# EAGLE schematic big_8x48 (EAGLE 6.2)
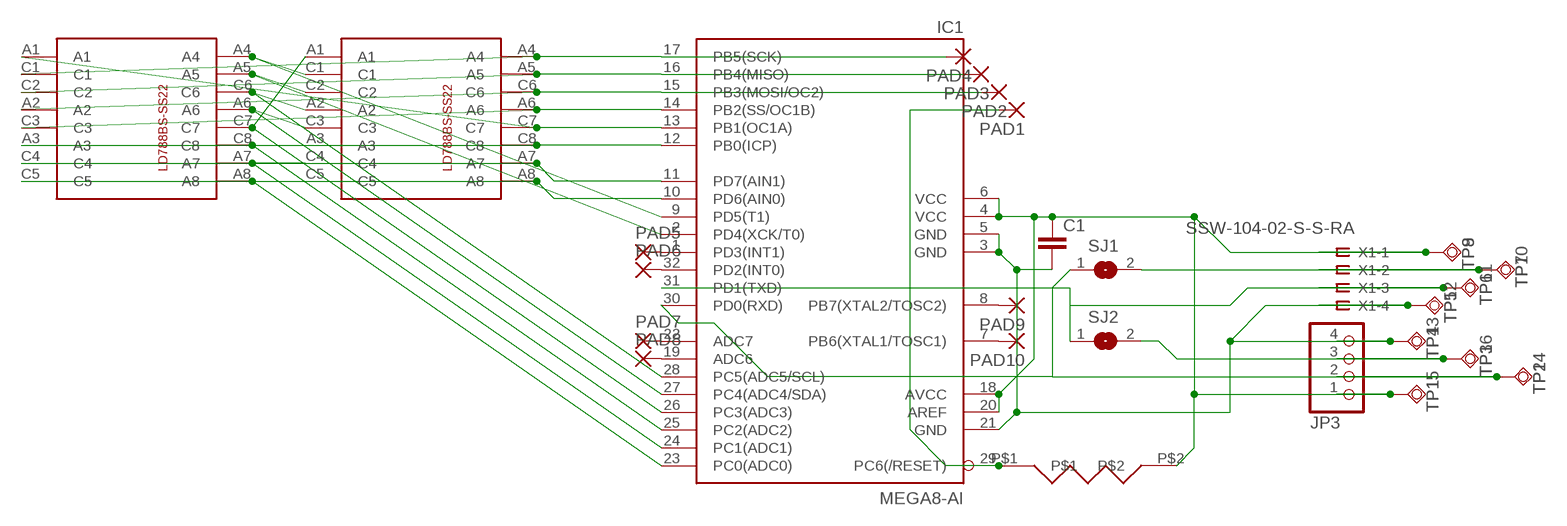
[diagram p0: schematic, sheet 1]

## Parts
C1  CAPPTH  [CAP-PTH-SMALL]
IC1  MEGA8-AI  [TQFP32-08]
JP3  PINHD-1X4/90  [1X04/90]
PAD1  1,6/0,8  [1,6/0,8]
PAD2  1,6/0,8  [1,6/0,8]
PAD3  1,6/0,8  [1,6/0,8]
PAD4  1,6/0,8  [1,6/0,8]
PAD5  1,6/0,8  [1,6/0,8]
PAD6  1,6/0,8  [1,6/0,8]
PAD7  1,6/0,8  [1,6/0,8]
PAD8  1,6/0,8  [1,6/0,8]
PAD9  1,6/0,8  [1,6/0,8]
PAD10  1,6/0,8  [1,6/0,8]
SJ1  SJ  [SJ]
SJ2  SJ  [SJ]
TP1  TPSQTP20SQ  [TP20SQ]
TP2  TPSQTP20SQ  [TP20SQ]
TP3  TPSQTP20SQ  [TP20SQ]
TP4  TPSQTP20SQ  [TP20SQ]
TP5  TPSQTP20SQ  [TP20SQ]
TP6  TPSQTP20SQ  [TP20SQ]
TP7  TPSQTP20SQ  [TP20SQ]
TP8  TPSQTP20SQ  [TP20SQ]
TP9  TPSQTP20SQ  [TP20SQ]
TP10  TPSQTP20SQ  [TP20SQ]
TP11  TPSQTP20SQ  [TP20SQ]
TP12  TPSQTP20SQ  [TP20SQ]
TP13  TPSQTP20SQ  [TP20SQ]
TP14  TPSQTP20SQ  [TP20SQ]
TP15  TPSQTP20SQ  [TP20SQ]
TP16  TPSQTP20SQ  [TP20SQ]
U$1  LD-1088BS  [LD-1088BS]
U$2  LD-1088BS  [LD-1088BS]
U$3  R-6  [R-6]
X1  SSW-104-02-S-S-RA  [SSW-104-02-S-S-RA]

## Nets
N$1: IC1.24(PC1(ADC1)) U$1.A7 U$2.C4
N$2: IC1.25(PC2(ADC2)) U$1.C8 U$2.A3
N$3: IC1.26(PC3(ADC3)) U$1.C7 U$2.A1
N$4: IC1.27(PC4(ADC4/SDA)) U$1.A6 U$2.C3
N$5: IC1.28(PC5(ADC5/SCL)) U$1.C6 U$2.A2
N$6: IC1.2(PD4(XCK/T0)) U$1.A5 U$2.C2
N$7: IC1.9(PD5(T1)) U$1.A4 U$2.C1
N$8: IC1.15(PB3(MOSI/OC2)) PAD2.1(P) U$1.A2 U$2.C6
N$9: IC1.14(PB2(SS/OC1B)) U$1.C3 U$2.A6
N$10: IC1.13(PB1(OC1A)) U$1.A1 U$2.C7
N$11: IC1.12(PB0(ICP)) U$1.A3 U$2.C8
N$12: IC1.11(PD7(AIN1)) U$1.C4 U$2.A7
N$13: IC1.10(PD6(AIN0)) U$1.C5 U$2.A8
N$14: IC1.16(PB4(MISO)) PAD3.1(P) U$1.C2 U$2.A5
N$15: IC1.17(PB5(SCK)) PAD4.1(P) U$1.C1 U$2.A4
N$16: IC1.1(PD3(INT1)) PAD5.1(P)
N$17: IC1.23(PC0(ADC0)) U$1.A8 U$2.C5
N$18: C1.2 IC1.3(GND) IC1.5(GND) IC1.21(GND) JP3.4 TP4.TP TP5.TP TP12.TP TP13.TP X1.4
N$19: C1.1 IC1.4(VCC) IC1.6(VCC) IC1.18(AVCC) IC1.20(AREF) JP3.1 TP1.TP TP8.TP TP9.TP TP15.TP U$3.P$2 X1.1
N$20: IC1.32(PD2(INT0)) PAD6.1(P)
N$21: SJ1.2 TP7.TP TP10.TP X1.2
N$22: JP3.3 SJ2.2 TP3.TP TP16.TP
N$23: IC1.31(PD1(TXD)) SJ2.1 TP6.TP TP11.TP X1.3
N$24: IC1.30(PD0(RXD)) JP3.2 SJ1.1 TP2.TP TP14.TP
N$25: IC1.29(PC6(/RESET)) PAD1.1(P) U$3.P$1
N$26: IC1.22(ADC7) PAD7.1(P)
N$27: IC1.19(ADC6) PAD8.1(P)
N$28: IC1.8(PB7(XTAL2/TOSC2)) PAD9.1(P)
N$29: IC1.7(PB6(XTAL1/TOSC1)) PAD10.1(P)

## Library data of the parts
C1 = SparkFun:CAP: Capacitor Standard 0603 ceramic capacitor, and 0.1" leaded capacitor.
IC1 = atmel:MEGA8: MICROCONTROLLER 8 Kbytes FLASH, 1 kbytes SRAM, 512 bytes EEPROM, USART, 6-channel 10 bit ADC, 2-channel 8 bit ADC Pin compatible with Atmega48, ATMega88, ATMega168 Source: avr.lbr; MPN: ATMEGA8-16AU; OC_FARNELL: 9171371; OC_NEWARK: 73M8863
JP3 = pinhead:PINHD-1X4: PIN HEADER
PAD1-PAD10 = wirepad:1,6/0,8: THROUGH-HOLE PAD
SJ1 SJ2 = jumper:SJ: SMD solder JUMPER
TP1-TP16 = testpad:TPSQ: Test pad
U$1 U$2 = mrule:LD-1088BS
U$3 = mrule:R-6
X1 = con-samtec:SSW-104-02-S-S: THROUGH-HOLE .025" SQ POST SOCKET Source: Samtec SSW.pdf; MPN: SSW-104-02-S-S-RA; OC_FARNELL: unknown; OC_NEWARK: 11P9385